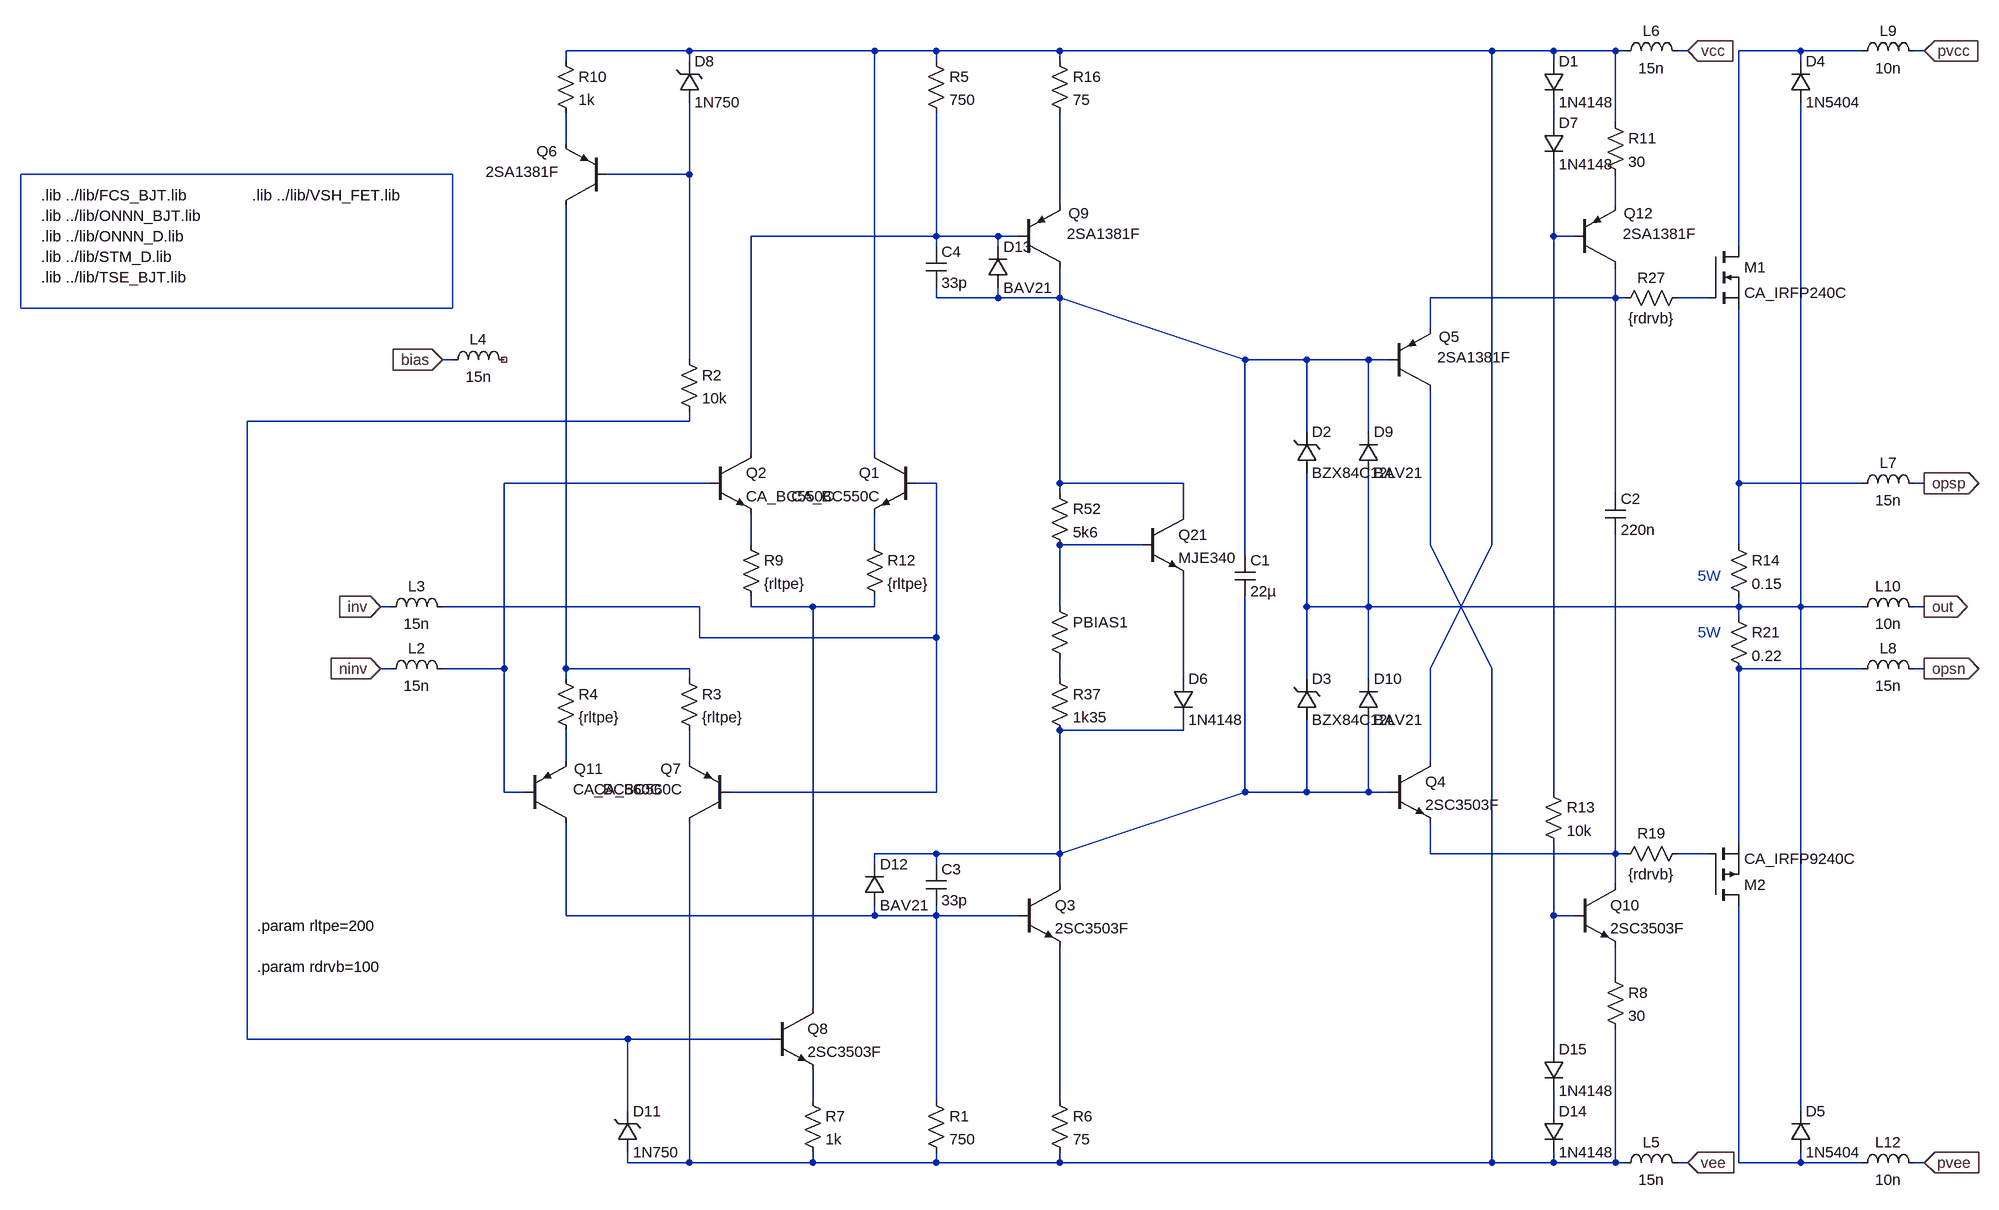
[diagram p0: schematic pab3bbb-compact-module-pp3.asc]
pab3bbb-compact-module-pp3.asc, the LTspice schematic file:
Version 4
SHEET 1 6124 2336
WIRE -96 -1088 -288 -1088
WIRE 192 -1088 -96 -1088
WIRE 288 -1088 192 -1088
WIRE 480 -1088 288 -1088
WIRE 1152 -1088 480 -1088
WIRE 1248 -1088 1152 -1088
WIRE 1344 -1088 1248 -1088
WIRE 1360 -1088 1344 -1088
WIRE 1456 -1088 1440 -1088
WIRE 1632 -1088 1536 -1088
WIRE 1728 -1088 1632 -1088
WIRE 1824 -1088 1808 -1088
WIRE -288 -1072 -288 -1088
WIRE -96 -1072 -96 -1088
WIRE 288 -1072 288 -1088
WIRE 480 -1072 480 -1088
WIRE 1248 -1072 1248 -1088
WIRE 1632 -1072 1632 -1088
WIRE 1248 -976 1248 -1008
WIRE 1344 -976 1344 -1088
WIRE -288 -944 -288 -992
WIRE -96 -896 -96 -1008
WIRE -96 -896 -224 -896
WIRE 480 -848 480 -992
WIRE 1344 -848 1344 -896
WIRE 288 -800 288 -992
WIRE 288 -800 0 -800
WIRE 384 -800 288 -800
WIRE 416 -800 384 -800
WIRE 1248 -800 1248 -912
WIRE 1280 -800 1248 -800
WIRE 288 -784 288 -800
WIRE 384 -784 384 -800
WIRE 1536 -784 1536 -1088
WIRE 288 -704 288 -720
WIRE 384 -704 384 -720
WIRE 384 -704 288 -704
WIRE 480 -704 480 -752
WIRE 480 -704 384 -704
WIRE 1344 -704 1344 -752
WIRE 1344 -704 1056 -704
WIRE 1360 -704 1344 -704
WIRE 1488 -704 1440 -704
WIRE 1056 -656 1056 -704
WIRE -464 -608 -480 -608
WIRE -96 -608 -96 -896
WIRE 768 -608 480 -704
WIRE 864 -608 768 -608
WIRE 960 -608 864 -608
WIRE 992 -608 960 -608
WIRE -96 -512 -96 -528
WIRE -96 -512 -784 -512
WIRE 864 -496 864 -608
WIRE 960 -496 960 -608
WIRE 0 -464 0 -800
WIRE 192 -464 192 -1088
WIRE -64 -416 -384 -416
WIRE 288 -416 256 -416
WIRE 480 -416 480 -704
WIRE 672 -416 480 -416
WIRE 1536 -416 1536 -688
WIRE 1728 -416 1536 -416
WIRE 1824 -416 1808 -416
WIRE 480 -400 480 -416
WIRE 1344 -400 1344 -704
WIRE 672 -368 672 -416
WIRE 0 -320 0 -368
WIRE 192 -320 192 -368
WIRE 608 -320 480 -320
WIRE 1056 -320 1056 -560
WIRE 1152 -320 1152 -1088
WIRE 1536 -320 1536 -416
WIRE 768 -304 768 -608
WIRE -560 -224 -576 -224
WIRE -80 -224 -480 -224
WIRE 0 -224 0 -240
WIRE 96 -224 0 -224
WIRE 192 -224 192 -240
WIRE 192 -224 96 -224
WIRE 480 -224 480 -320
WIRE 864 -224 864 -432
WIRE 960 -224 960 -432
WIRE 960 -224 864 -224
WIRE 1536 -224 1536 -240
WIRE 1536 -224 960 -224
WIRE 1632 -224 1632 -1008
WIRE 1632 -224 1536 -224
WIRE 1728 -224 1632 -224
WIRE 1824 -224 1808 -224
WIRE 1536 -208 1536 -224
WIRE -80 -176 -80 -224
WIRE 288 -176 288 -416
WIRE 288 -176 -80 -176
WIRE -560 -128 -576 -128
WIRE -384 -128 -384 -416
WIRE -384 -128 -480 -128
WIRE -288 -128 -288 -848
WIRE -96 -128 -288 -128
WIRE 1056 -128 1152 -320
WIRE 1152 -128 1056 -320
WIRE 1728 -128 1536 -128
WIRE 1824 -128 1808 -128
WIRE -288 -112 -288 -128
WIRE -96 -112 -96 -128
WIRE 480 -112 480 -144
WIRE 672 -112 672 -272
WIRE 864 -112 864 -224
WIRE 960 -112 960 -224
WIRE 672 -32 672 -48
WIRE 672 -32 480 -32
WIRE -288 16 -288 -32
WIRE -96 16 -96 -32
WIRE 1056 16 1056 -128
WIRE -384 64 -384 -128
WIRE -352 64 -384 64
WIRE 288 64 288 -176
WIRE 288 64 -32 64
WIRE 768 64 768 -240
WIRE 864 64 864 -48
WIRE 864 64 768 64
WIRE 960 64 960 -48
WIRE 960 64 864 64
WIRE 992 64 960 64
WIRE 1248 64 1248 -800
WIRE 1536 144 1536 -128
WIRE 288 160 192 160
WIRE 480 160 480 -32
WIRE 480 160 768 64
WIRE 480 160 288 160
WIRE 1056 160 1056 112
WIRE 1344 160 1344 -336
WIRE 1344 160 1056 160
WIRE 1360 160 1344 160
WIRE 1488 160 1440 160
WIRE 192 176 192 160
WIRE 288 176 288 160
WIRE 480 208 480 160
WIRE 1344 208 1344 160
WIRE -288 256 -288 112
WIRE 192 256 192 240
WIRE 192 256 -288 256
WIRE 288 256 288 240
WIRE 288 256 192 256
WIRE 416 256 288 256
WIRE 1248 256 1248 144
WIRE 1280 256 1248 256
WIRE 1344 352 1344 304
WIRE 96 400 96 -224
WIRE -784 448 -784 -512
WIRE -192 448 -784 448
WIRE 32 448 -192 448
WIRE 1248 464 1248 256
WIRE 96 544 96 496
WIRE 288 544 288 256
WIRE 480 544 480 304
WIRE -192 560 -192 448
WIRE 1248 560 1248 528
WIRE 1632 560 1632 -224
WIRE -192 640 -192 624
WIRE -96 640 -96 112
WIRE -96 640 -192 640
WIRE 96 640 96 624
WIRE 96 640 -96 640
WIRE 288 640 288 624
WIRE 288 640 96 640
WIRE 480 640 480 624
WIRE 480 640 288 640
WIRE 1152 640 1152 -128
WIRE 1152 640 480 640
WIRE 1248 640 1248 624
WIRE 1248 640 1152 640
WIRE 1344 640 1344 432
WIRE 1344 640 1248 640
WIRE 1360 640 1344 640
WIRE 1456 640 1440 640
WIRE 1536 640 1536 240
WIRE 1632 640 1632 624
WIRE 1632 640 1536 640
WIRE 1728 640 1632 640
WIRE 1824 640 1808 640
FLAG 1824 -1088 pvcc
IOPIN 1824 -1088 In
FLAG 1824 640 pvee
IOPIN 1824 640 In
FLAG 1824 -224 out
IOPIN 1824 -224 Out
FLAG 1456 -1088 vcc
IOPIN 1456 -1088 In
FLAG 1456 640 vee
IOPIN 1456 640 In
FLAG -576 -128 ninv
IOPIN -576 -128 In
FLAG -576 -224 inv
IOPIN -576 -224 In
FLAG 1824 -416 opsp
IOPIN 1824 -416 Out
FLAG 1824 -128 opsn
IOPIN 1824 -128 Out
FLAG -480 -608 bias
IOPIN -480 -608 In
SYMBOL pnp -352 112 M180
WINDOW 0 77 84 Left 2
WINDOW 3 75 52 Left 2
SYMATTR InstName Q11
SYMATTR Value CA_BC560C
SYMBOL res 464 -1088 R0
SYMATTR InstName R16
SYMATTR Value 75
SYMBOL res 1456 -720 R90
WINDOW 0 0 56 VBottom 2
WINDOW 3 32 56 VTop 2
SYMATTR InstName R27
SYMATTR Value {rdrvb}
SYMBOL res 464 -240 R0
WINDOW 3 36 76 Invisible 2
SYMATTR Value {1+(500*BIAS)}
SYMATTR InstName PBIAS1
SYMBOL res 464 -416 R0
SYMATTR InstName R52
SYMATTR Value 5k6
SYMBOL npn 416 208 R0
SYMATTR InstName Q3
SYMATTR Value 2SC3503F
SYMBOL res 464 528 R0
SYMATTR InstName R6
SYMATTR Value 75
SYMBOL pnp -32 112 R180
WINDOW 0 77 84 Left 2
WINDOW 3 75 52 Left 2
SYMATTR InstName Q7
SYMATTR Value CA_BC560C
SYMBOL npn 608 -368 R0
SYMATTR InstName Q21
SYMATTR Value MJE340
SYMBOL res 464 -128 R0
SYMATTR InstName R37
SYMATTR Value 1k35
SYMBOL res 1520 -336 R0
SYMATTR InstName R14
SYMATTR Value 0.15
SYMBOL res 1520 -224 R0
SYMATTR InstName R21
SYMATTR Value 0.22
SYMBOL ind 1344 656 R270
WINDOW 0 32 56 VTop 2
WINDOW 3 5 56 VBottom 2
SYMATTR InstName L5
SYMATTR Value 15n
SYMATTR SpiceLine Rser=20m
SYMBOL ind 1344 -1072 R270
WINDOW 0 32 56 VTop 2
WINDOW 3 5 56 VBottom 2
SYMATTR InstName L6
SYMATTR Value 15n
SYMATTR SpiceLine Rser=20m
SYMBOL ind 1712 -400 R270
WINDOW 0 32 56 VTop 2
WINDOW 3 5 56 VBottom 2
SYMATTR InstName L7
SYMATTR Value 15n
SYMATTR SpiceLine Rser=20m
SYMBOL ind 1712 -112 R270
WINDOW 0 32 56 VTop 2
WINDOW 3 5 56 VBottom 2
SYMATTR InstName L8
SYMATTR Value 15n
SYMATTR SpiceLine Rser=20m
SYMBOL ind -576 -112 R270
WINDOW 0 32 56 VTop 2
WINDOW 3 5 56 VBottom 2
SYMATTR InstName L2
SYMATTR Value 15n
SYMATTR SpiceLine Rser=20m
SYMBOL ind -576 -208 R270
WINDOW 0 32 56 VTop 2
WINDOW 3 5 56 VBottom 2
SYMATTR InstName L3
SYMATTR Value 15n
SYMATTR SpiceLine Rser=20m
SYMBOL ind 1712 -208 R270
WINDOW 0 32 56 VTop 2
WINDOW 3 5 56 VBottom 2
SYMATTR InstName L10
SYMATTR Value 10n
SYMATTR SpiceLine Rser=10m
SYMBOL ind 1712 -1072 R270
WINDOW 0 32 56 VTop 2
WINDOW 3 5 56 VBottom 2
SYMATTR InstName L9
SYMATTR Value 10n
SYMATTR SpiceLine Rser=10m
SYMBOL ind 1712 656 R270
WINDOW 0 32 56 VTop 2
WINDOW 3 5 56 VBottom 2
SYMATTR InstName L12
SYMATTR Value 10n
SYMATTR SpiceLine Rser=10m
SYMBOL ind -480 -592 R270
WINDOW 0 32 56 VTop 2
WINDOW 3 5 56 VBottom 2
SYMATTR InstName L4
SYMATTR Value 15n
SYMATTR SpiceLine Rser=20m
SYMBOL zener 848 -432 M180
WINDOW 0 24 64 Left 2
WINDOW 3 24 0 Left 2
SYMATTR InstName D2
SYMATTR Value BZX84C12L
SYMATTR Description Diode
SYMATTR Type diode
SYMBOL diode 1616 -1008 M180
WINDOW 0 24 64 Left 2
WINDOW 3 24 0 Left 2
SYMATTR InstName D4
SYMATTR Value 1N5404
SYMBOL diode 1616 624 M180
WINDOW 0 24 64 Left 2
WINDOW 3 24 0 Left 2
SYMATTR InstName D5
SYMATTR Value 1N5404
SYMBOL res 1456 144 R90
WINDOW 0 0 56 VBottom 2
WINDOW 3 32 56 VTop 2
SYMATTR InstName R19
SYMATTR Value {rdrvb}
SYMBOL nmos 1488 -784 R0
SYMATTR InstName M1
SYMATTR Value CA_IRFP240C
SYMBOL pmos 1488 240 M180
SYMATTR InstName M2
SYMATTR Value CA_IRFP9240C
SYMBOL diode 656 -112 R0
SYMATTR InstName D6
SYMATTR Value 1N4148
SYMBOL pnp 416 -752 M180
WINDOW 0 77 84 Left 2
WINDOW 3 75 52 Left 2
SYMATTR InstName Q9
SYMATTR Value 2SA1381F
SYMBOL zener 848 -48 M180
WINDOW 0 24 64 Left 2
WINDOW 3 24 0 Left 2
SYMATTR InstName D3
SYMATTR Value BZX84C12L
SYMATTR Description Diode
SYMATTR Type diode
SYMBOL diode 944 -432 M180
WINDOW 0 24 64 Left 2
WINDOW 3 24 0 Left 2
SYMATTR InstName D9
SYMATTR Value BAV21
SYMBOL diode 944 -48 M180
WINDOW 0 24 64 Left 2
WINDOW 3 24 0 Left 2
SYMATTR InstName D10
SYMATTR Value BAV21
SYMBOL res 272 528 R0
SYMATTR InstName R1
SYMATTR Value 750
SYMBOL res 272 -1088 R0
SYMATTR InstName R5
SYMATTR Value 750
SYMBOL cap 752 -304 R0
SYMATTR InstName C1
SYMATTR Value 22µ
SYMBOL res -304 -128 R0
SYMATTR InstName R4
SYMATTR Value {rltpe}
SYMBOL npn 992 16 R0
SYMATTR InstName Q4
SYMATTR Value 2SC3503F
SYMBOL pnp 992 -560 M180
WINDOW 0 77 84 Left 2
WINDOW 3 75 52 Left 2
SYMATTR InstName Q5
SYMATTR Value 2SA1381F
SYMBOL cap 1328 -400 R0
SYMATTR InstName C2
SYMATTR Value 220n
SYMBOL cap 272 176 R0
SYMATTR InstName C3
SYMATTR Value 33p
SYMBOL cap 272 -784 R0
SYMATTR InstName C4
SYMATTR Value 33p
SYMBOL res -112 -128 R0
SYMATTR InstName R3
SYMATTR Value {rltpe}
SYMBOL pnp -224 -848 R180
WINDOW 0 77 84 Left 2
WINDOW 3 75 52 Left 2
SYMATTR InstName Q6
SYMATTR Value 2SA1381F
SYMBOL res -304 -1088 R0
SYMATTR InstName R10
SYMATTR Value 1k
SYMBOL zener -112 -1008 M180
WINDOW 0 24 64 Left 2
WINDOW 3 24 0 Left 2
SYMATTR InstName D8
SYMATTR Value 1N750
SYMATTR Description Diode
SYMATTR Type diode
SYMBOL npn 256 -464 M0
SYMATTR InstName Q1
SYMATTR Value CA_BC550C
SYMBOL npn -64 -464 R0
SYMATTR InstName Q2
SYMATTR Value CA_BC550C
SYMBOL npn 32 400 R0
SYMATTR InstName Q8
SYMATTR Value 2SC3503F
SYMBOL zener -208 624 M180
WINDOW 0 24 64 Left 2
WINDOW 3 24 0 Left 2
SYMATTR InstName D11
SYMATTR Value 1N750
SYMATTR Description Diode
SYMATTR Type diode
SYMBOL res -112 -624 R0
SYMATTR InstName R2
SYMATTR Value 10k
SYMBOL res 80 528 R0
SYMATTR InstName R7
SYMATTR Value 1k
SYMBOL res -16 -336 R0
SYMATTR InstName R9
SYMATTR Value {rltpe}
SYMBOL res 176 -336 R0
SYMATTR InstName R12
SYMATTR Value {rltpe}
SYMBOL diode 176 240 M180
WINDOW 0 24 64 Left 2
WINDOW 3 24 0 Left 2
SYMATTR InstName D12
SYMATTR Value BAV21
SYMBOL diode 368 -720 M180
WINDOW 0 24 64 Left 2
WINDOW 3 24 0 Left 2
SYMATTR InstName D13
SYMATTR Value BAV21
SYMBOL npn 1280 208 R0
SYMATTR InstName Q10
SYMATTR Value 2SC3503F
SYMBOL pnp 1280 -752 M180
WINDOW 0 77 84 Left 2
WINDOW 3 75 52 Left 2
SYMATTR InstName Q12
SYMATTR Value 2SA1381F
SYMBOL diode 1232 -1072 R0
SYMATTR InstName D1
SYMATTR Value 1N4148
SYMBOL diode 1232 -976 R0
SYMATTR InstName D7
SYMATTR Value 1N4148
SYMBOL diode 1232 560 R0
SYMATTR InstName D14
SYMATTR Value 1N4148
SYMBOL diode 1232 464 R0
SYMATTR InstName D15
SYMATTR Value 1N4148
SYMBOL res 1328 336 R0
SYMATTR InstName R8
SYMATTR Value 30
SYMBOL res 1328 -992 R0
SYMATTR InstName R11
SYMATTR Value 30
SYMBOL res 1232 48 R0
SYMATTR InstName R13
SYMATTR Value 10k
TEXT -768 272 Left 2 !.param rltpe=200
TEXT 1472 -272 Left 2 ;5W
TEXT 1472 -184 Left 2 ;5W
TEXT -1104 -832 Left 2 !.lib ../lib/ONNN_BJT.lib
TEXT -1104 -768 Left 2 !.lib ../lib/STM_D.lib
TEXT -1104 -864 Left 2 !.lib ../lib/FCS_BJT.lib
TEXT -1104 -800 Left 2 !.lib ../lib/ONNN_D.lib
TEXT -1104 -736 Left 2 !.lib ../lib/TSE_BJT.lib
TEXT -768 336 Left 2 !.param rdrvb=100
TEXT -776 -864 Left 2 !.lib ../lib/VSH_FET.lib
RECTANGLE Normal -464 -688 -1136 -896

The netlist it stands for:
* pab3bbb-compact-module-pp3.asc
Q11 N032 N014 N028 0 CA_BC560C
R16 N001 N006 75
R27 N012 N011 {rdrvb}
R§PBIAS1 N019 N025 {1+(500*BIAS)}
R52 N010 N019 5k6
Q3 N027 N032 N036 0 2SC3503F
R6 N036 N020 75
Q7 N020 N015 N029 0 CA_BC560C
Q21 N010 N019 N026 0 MJE340
R37 N025 N027 1k35
R14 N016 N022 0.15
R21 N022 N024 0.22
L5 N020 vee 15n Rser=20m
L6 N001 vcc 15n Rser=20m
L7 N016 opsp 15n Rser=20m
L8 N024 opsn 15n Rser=20m
L2 ninv N014 15n Rser=20m
L3 inv N015 15n Rser=20m
L10 N022 out 10n Rser=10m
L9 N002 pvcc 10n Rser=10m
L12 N038 pvee 10n Rser=10m
L4 bias NC_01 15n Rser=20m
D2 N022 N010 BZX84C12L
D4 N022 N002 1N5404
D5 N038 N022 1N5404
R19 N031 N030 {rdrvb}
M1 N002 N012 N016 N016 CA_IRFP240C
M2 N038 N031 N024 N024 CA_IRFP9240C
D6 N026 N027 1N4148
Q9 N010 N008 N006 0 2SA1381F
D3 N027 N022 BZX84C12L
D9 N022 N010 BAV21
D10 N027 N022 BAV21
R1 N032 N020 750
R5 N001 N008 750
C1 N010 N027 22µ
R4 N023 N028 {rltpe}
Q4 N001 N027 N030 0 2SC3503F
Q5 N020 N010 N011 0 2SA1381F
C2 N011 N030 220n
C3 N027 N032 33p
C4 N008 N010 33p
R3 N023 N029 {rltpe}
Q6 N023 N005 N004 0 2SA1381F
R10 N001 N004 1k
D8 N005 N001 1N750
Q1 N001 N015 N018 0 CA_BC550C
Q2 N008 N014 N017 0 CA_BC550C
Q8 N021 N013 N035 0 2SC3503F
D11 N020 N013 1N750
R2 N005 N013 10k
R7 N035 N020 1k
R9 N017 N021 {rltpe}
R12 N018 N021 {rltpe}
D12 N032 N027 BAV21
D13 N010 N008 BAV21
Q10 N030 N033 N034 0 2SC3503F
Q12 N011 N009 N007 0 2SA1381F
D1 N001 N003 1N4148
D7 N003 N009 1N4148
D14 N037 N020 1N4148
D15 N033 N037 1N4148
R8 N034 N020 30
R11 N001 N007 30
R13 N009 N033 10k
.model D D
.lib standard.dio
.model NPN NPN
.model PNP PNP
.lib standard.bjt
.model NMOS NMOS
.model PMOS PMOS
.lib standard.mos
.param rltpe=200
* 5W
* 5W
.lib ../lib/ONNN_BJT.lib
.lib ../lib/STM_D.lib
.lib ../lib/FCS_BJT.lib
.lib ../lib/ONNN_D.lib
.lib ../lib/TSE_BJT.lib
.param rdrvb=100
.lib ../lib/VSH_FET.lib
.backanno
.end